# EAGLE board Melody (EAGLE 6.5.0)
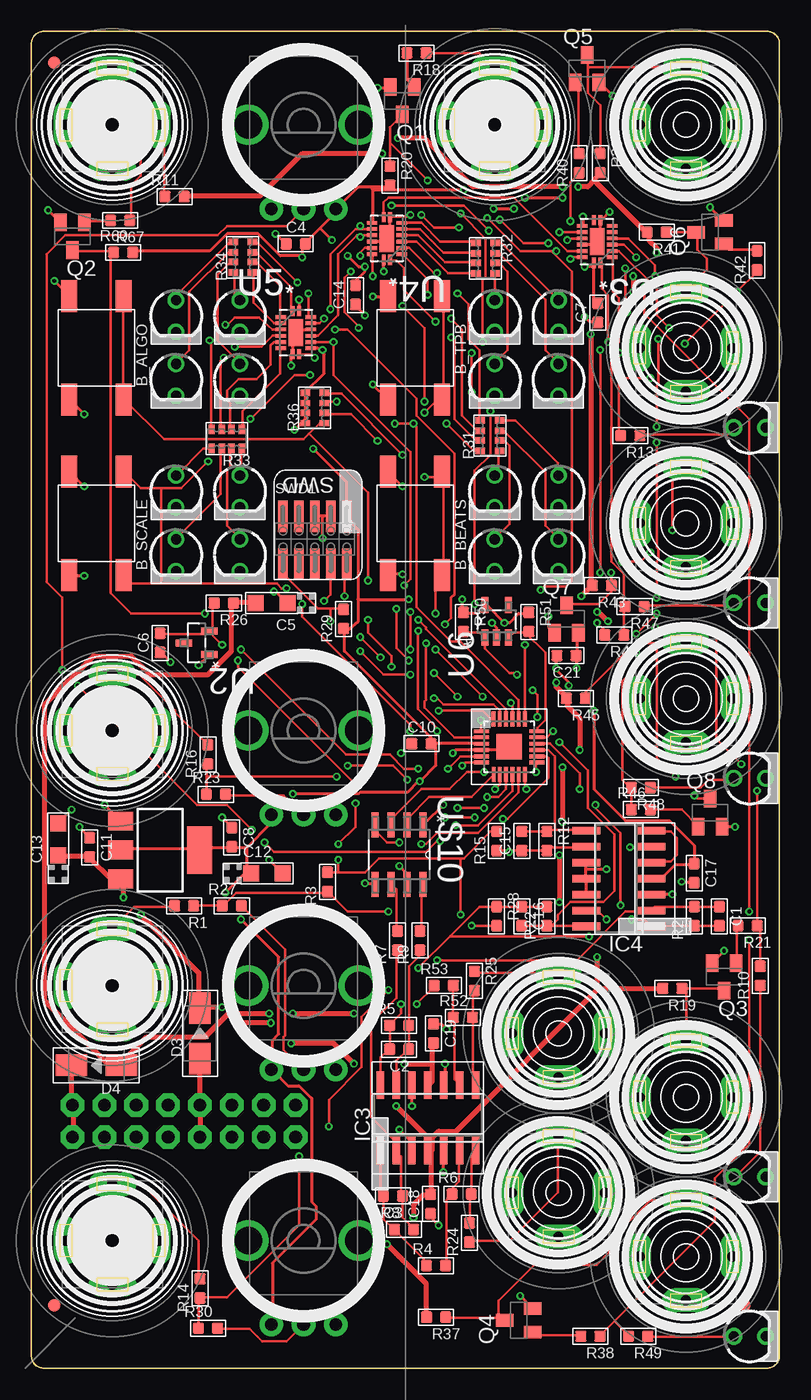
[diagram p2: board, top side]
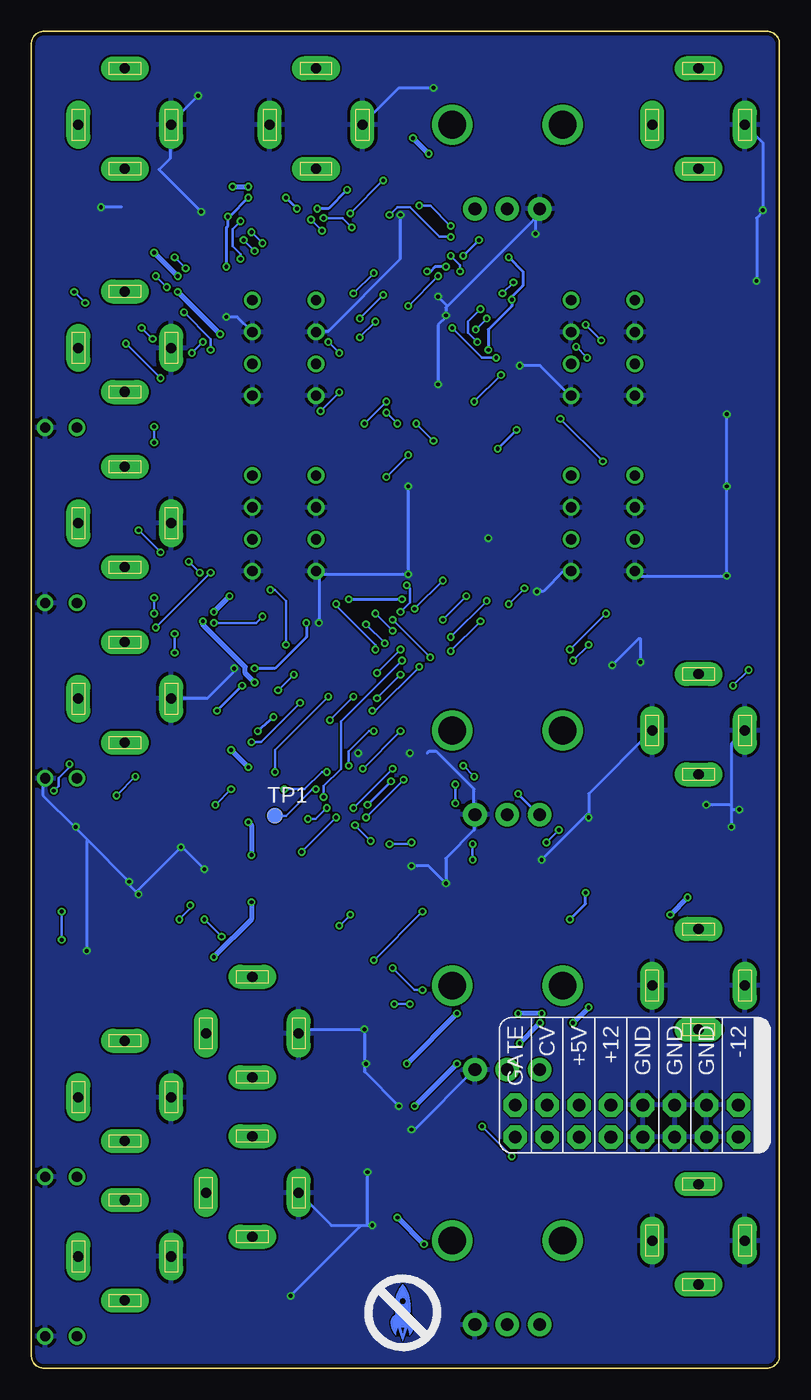
[diagram p3: board, bottom side, seen from below]

Size 59.62 x 106.5 mm. Coordinates in mm from the lower left corner, seen from the top.
Copper layers (1*16): Top 0.035mm / dielectric 1.5mm / Bottom 0.035mm
Design rules "dirt_cheap_dirty_boards.v1": minimum track width 5mil, minimum drill 12mil, track to track 5mil, track to pad 5mil, pad to pad 5mil, via to via 5mil, smd to smd 0mil, copper to edge 10mil, drill to drill 10mil, minimum pad ring 10mil, minimum via ring 6mil, stop-mask expansion 2mil, vias tented up to drill 25mil, thermal gap 10mil
Net classes: 0 default: width 0.203 mm, clearance 0.203 mm; 1 heavypower: width 0.381 mm; 2 mediumpower: width 0.254 mm

## Footprints (pad centres in the part's own frame; a part is rotated, then mirrored left to right if it is on the bottom)
3.5MM-JACK-SWITCH-13MM-OUTPUT = drill 0.8 pad 1.93 long: RING@3 -3.7,0; SECOND@3 0,-3.5; SWITCH@3 3.7,0; TIP@3 0,4.5
4P-SMD-6.0X6.0X5.0H = smd 2.54 x 1.27: 1 -4.129,2.159; 2 -4.129,-2.159; 3 4.129,-2.159; 4 4.129,2.159
C0603 = smd 0.889 x 0.889: 1 -0.762,0; 2 0.762,0
AVX-A = smd 1.27 x 1.27: + -1.27,0; - 1.27,0
3.5MM-JACK-SWITCH-13MM-INPUT = drill 0.8 pad 1.93 long: RING@3 -3.7,0; SECOND@3 0,-3.5; SWITCH@3 3.7,0; TIP@3 0,4.5
DO-214AC = smd 2.5 x 1.7: 1 -2,0; 2 2,0
SOT223 = smd 1.5 x 2: 1 -2.3,-3.15; 2 0,-3.15; 3 2.3,-3.15 | smd 3.8 x 2: 4 0,3.15
SO14 = smd 0.6 x 2.2: 1 -3.81,-2.6; 2 -2.54,-2.6; 3 -1.27,-2.6; 4 0,-2.6; 5 1.27,-2.6; 6 2.54,-2.6; 7 3.81,-2.6; 8 3.81,2.6; 9 2.54,2.6; 10 1.27,2.6; 11 0,2.6; 12 -1.27,2.6; 13 -2.54,2.6; 14 -3.81,2.6
LED3MM = drill 0.813: A -1.27,0; K 1.27,0
OG-POTS_ALPS_POT_VERTICAL = drill 1 pad 1.88: P$1 -2.58,-6.7; P$2 0,-6.7; P$3 2.58,-6.7 | drill 2.2 pad 3.175: P$4 4.4,0; P$5 -4.4,0
SOT23-BEC = smd 1 x 1.4: B -0.95,-1.1; C 0,1.1; E 0.95,-1.1
R0603 = smd 0.889 x 0.889: 1 -0.762,0; 2 0.762,0
R1206-8 = smd 0.508 x 0.762: 1 -1.206,-0.762; 2 -0.381,-0.762; 3 0.381,-0.762; 4 1.206,-0.762; 5 1.206,0.762; 6 0.381,0.762; 7 -0.381,0.762; 8 -1.206,0.762
M50-3600542 = smd 0.75 x 2.5: 1 -2.54,-1.81; 2 -2.54,2; 3 -1.27,-1.81; 4 -1.27,2; 5 0,-1.81; 6 0,2; 7 1.27,-1.81; 8 1.27,2; 9 2.54,-1.81; 10 2.54,2
B1,27 = smd 1.27 x 1.27: TP 0,0
QFN50P400X400X100-25N = smd 1.2 x 0.3: 1 -2.2,1.245; 2 -2.2,0.762; 3 -2.2,0.254; 4 -2.2,-0.254; 5 -2.2,-0.762; 6 -2.2,-1.245; 13 2.2,-1.245; 14 2.2,-0.762; 15 2.2,-0.254; 16 2.2,0.254; 17 2.2,0.762; 18 2.2,1.245 | smd 0.3 x 1.2: 7 -1.245,-2.2; 8 -0.762,-2.2; 9 -0.254,-2.2; 10 0.254,-2.2; 11 0.762,-2.2; 12 1.245,-2.2; 19 1.245,2.2; 20 0.762,2.2; 21 0.254,2.2; 22 -0.254,2.2 | smd 0.305 x 1.2: 23 -0.762,2.2; 24 -1.245,2.2 | smd 2.032 x 2.032: 25 0,0
SOT95P237X112-3N = smd 1.321 x 0.559: 1 -1.016,0.94; 2 -1.016,-0.94; 3 1.016,0
QFN50P250X350X100-17N = smd 0.305 x 0.813: 1 -0.254,1.702; 8 -0.254,-1.702; 9 0.254,-1.702; 16 0.254,1.702 | smd 0.813 x 0.305: 2 -1.194,1.245; 3 -1.194,0.762; 4 -1.194,0.254; 5 -1.194,-0.254; 6 -1.194,-0.762; 7 -1.194,-1.245; 10 1.194,-1.245; 11 1.194,-0.762; 12 1.194,-0.254; 13 1.194,0.254; 14 1.194,0.762; 15 1.194,1.245 | smd 1.143 x 2.159: 17 0,0
SOT95P290X145-5N = smd 1.27 x 0.559: 1 -1.295,0.94; 2 -1.295,0; 3 -1.295,-0.94; 4 1.295,-0.94; 5 1.295,0.94
POWER_16 = drill 1.016 pad 1.88 octagon: 1 -6.35,-1.27; 2 -6.35,1.27; 3 -3.81,-1.27; 4 -3.81,1.27; 5 -1.27,-1.27; 6 -1.27,1.27; 7 1.27,-1.27; 8 1.27,1.27; 9 3.81,-1.27; 10 3.81,1.27; 11 6.35,-1.27; 12 6.35,1.27; 13 8.89,-1.27; 14 8.89,1.27; 15 11.43,-1.27; 16 11.43,1.27
FIDUCIAL_1MM = smd 1 x 1: 1 0,0
SOIC8-N_MC = smd 1.981 x 0.559: 1 -2.362,1.905; 2 -2.362,0.635; 3 -2.362,-0.635; 4 -2.362,-1.905; 5 2.362,-1.905; 6 2.362,-0.635; 7 2.362,0.635; 8 2.362,1.905

## Placement (x,y rotation side)
ACCENT  PJ-341  [3.5MM-JACK-SWITCH-13MM-OUTPUT]  52.17,21.59 0 top
B_ALGO  BUTTON-4P-3100010P1  [4P-SMD-6.0X6.0X5.0H]  5.18,81.28 270 top
B_BEATS  BUTTON-4P-3100010P1  [4P-SMD-6.0X6.0X5.0H]  30.58,67.31 270 top
B_SCALE  BUTTON-4P-3100010P1  [4P-SMD-6.0X6.0X5.0H]  5.18,67.31 270 top
B_TPB  BUTTON-4P-3100010P1  [4P-SMD-6.0X6.0X5.0H]  30.58,81.28 270 top
BEAT  PJ-341  [3.5MM-JACK-SWITCH-13MM-OUTPUT]  52.17,67.31 0 top
C1  3.3nF  [C0603]  54.83,36 270 top
C2  3.3nF  [C0603]  29.31,25.4 180 top
C3  3.3nF  [C0603]  28.81,13.72 180 top
C4  100nF  [C0603]  21.06,89.57 0 top
C5  10uF  [AVX-A]  19.15,60.96 180 top
C6  1uF  [C0603]  10.26,57.78 90 top
C7  100nF  [C0603]  45.14,84.08 90 top
C8  100nF  [C0603]  15.97,42.3 270 top
C10  100nF  [C0603]  31.08,49.75 0 top
C11  100nF  [C0603]  4.65,41.49 270 top
C12  10uF  [AVX-A]  18.77,39.41 0 top
C13  10uF  [AVX-A]  2.15,42.12 90 top
C14  100nF  [C0603]  25.83,85.5 90 top
C15  3.3nF  [C0603]  39.08,42 90 top
C16  3.3nF  [C0603]  39.08,36 270 top
C17  100nF  [C0603]  52.81,39.43 270 top
C18  100nF 16V+  [C0603]  31.81,13.08 90 top
C19  100nF 16V+  [C0603]  32.06,26.66 270 top
C21  100nF  [C0603]  42.64,56.77 180 top
CLOCK  PJ-341  [3.5MM-JACK-SWITCH-13MM-INPUT]  6.45,99.06 0 top
CLOCKOUT_JACK  PJ-341  [3.5MM-JACK-SWITCH-13MM-OUTPUT]  52.17,99.06 0 top
D3  MRA4004T3G  [DO-214AC]  13.44,26.67 90 top
D4  MRA4004T3G  [DO-214AC]  5.18,24.13 180 top
GATE  PJ-341  [3.5MM-JACK-SWITCH-13MM-OUTPUT]  52.17,8.89 0 top
IC1  LD1117AS33TR  [SOT223]  10.26,41.27 270 top
IC3  TL074D  [SO14]  31.6,19.93 0 top
IC4  MCP6004  [SO14]  46.83,39 90 top
IN1  PJ-341  [3.5MM-JACK-SWITCH-13MM-INPUT]  6.45,50.8 0 top
IN2  PJ-341  [3.5MM-JACK-SWITCH-13MM-INPUT]  6.45,30.48 0 top
INTENSITY  PJ-341  [3.5MM-JACK-SWITCH-13MM-INPUT]  6.45,10.16 0 top
LED_ACCENT  WHITE 3MM WITH 11MM HOLDER  [LED3MM]  57.25,15.24 0 top
LED_ALGO_FLAT  WHITE_WITH_11MM_SPACER  [LED3MM]  11.53,83.82 270 top
LED_ALGO_FOURCHORD  WHITE 3MM WITH 11MM HOLDER  [LED3MM]  16.61,83.82 270 top
LED_ALGO_GOA  WHITE 3MM WITH 11MM HOLDER  [LED3MM]  11.53,78.74 270 top
LED_ALGO_PSYCH  WHITE 3MM WITH 11MM HOLDER  [LED3MM]  16.61,78.74 270 top
LED_BEAT  WHITE 3MM WITH 11MM HOLDER  [LED3MM]  57.25,60.96 0 top
LED_BEAT_2  WHITE 3MM WITH 11MM HOLDER  [LED3MM]  42.01,69.85 270 top
LED_BEAT_4  WHITE 3MM WITH 11MM HOLDER  [LED3MM]  36.93,69.85 270 top
LED_BEAT_8  WHITE 3MM WITH 11MM HOLDER  [LED3MM]  36.93,64.77 270 top
LED_BEAT_16  WHITE 3MM WITH 11MM HOLDER  [LED3MM]  42.01,64.77 270 top
LED_GATE  WHITE 3MM WITH 11MM HOLDER  [LED3MM]  57.25,2.54 0 top
LED_LOOP  WHITE 3MM WITH 11MM HOLDER  [LED3MM]  57.25,46.99 0 top
LED_SCALE_DORIAN  WHITE 3MM WITH 11MM HOLDER  [LED3MM]  11.53,64.77 270 top
LED_SCALE_MAJOR  WHITE 3MM WITH 11MM HOLDER  [LED3MM]  11.53,69.85 270 top
LED_SCALE_MINOR  WHITE 3MM WITH 11MM HOLDER  [LED3MM]  16.61,64.77 270 top
LED_SCALE_PENTA  WHITE 3MM WITH 11MM HOLDER  [LED3MM]  16.61,69.85 270 top
LED_TICK  WHITE 3MM WITH 11MM HOLDER  [LED3MM]  57.25,74.93 0 top
LED_TPB_2  WHITE 3MM WITH 11MM HOLDER  [LED3MM]  42.01,83.82 270 top
LED_TPB_3  WHITE 3MM WITH 11MM HOLDER  [LED3MM]  42.01,78.74 270 top
LED_TPB_4  WHITE 3MM WITH 11MM HOLDER  [LED3MM]  36.93,83.82 270 top
LED_TPB_6  WHITE 3MM WITH 11MM HOLDER  [LED3MM]  36.93,78.74 270 top
LOOP  PJ-341  [3.5MM-JACK-SWITCH-13MM-OUTPUT]  52.17,53.34 0 top
NOTE  PJ-341  [3.5MM-JACK-SWITCH-13MM-OUTPUT]  42.01,13.97 0 top
POT_IN1  SEED A  [OG-POTS_ALPS_POT_VERTICAL]  21.69,50.8 0 top
POT_IN2  SEED B  [OG-POTS_ALPS_POT_VERTICAL]  21.69,30.48 0 top
POT_TEMPO  TEMPO  [OG-POTS_ALPS_POT_VERTICAL]  21.69,99.06 0 top
Q1  MMBT3904  [SOT23-BEC]  29.56,100.97 180 top
Q2  MMBT3904  [SOT23-BEC]  3.28,90.17 180 top
Q3  MMBT3904  [SOT23-BEC]  55.21,31.18 180 top
Q4  MMBT3904  [SOT23-BEC]  38.84,3.81 90 top
Q5  MMBT3904  [SOT23-BEC]  44.27,103.53 0 top
Q6  MMBT3904  [SOT23-BEC]  54.08,90.5 90 top
Q7  MMBT3904  [SOT23-BEC]  42.64,59.69 0 top
Q8  MMBT3904  [SOT23-BEC]  54.08,44.25 0 top
R1  100k 1%  [R0603]  12.17,36.83 180 top
R2  33k 1%  [R0603]  52.83,36 90 top
R3  49.9k 1%  [R0603]  23.59,38.73 90 top
R4  100k  [R0603]  32.25,8.17 0 top
R5  25.5k 1%  [R0603]  29.31,27.3 0 top
R6  100k  [R0603]  34.29,13.87 0 top
R7  10.2k 1%  [R0603]  29.17,34.06 90 top
R8  25.5k 1%  [R0603]  29.7,11.04 0 top
R9  10.2k 1%  [R0603]  30.96,34.06 90 top
R10  2k  [R0603]  58.08,31.25 90 top
R11  10k  [R0603]  11.42,93.34 0 top
R12  33k 1%  [R0603]  41.08,42 270 top
R13  2k  [R0603]  47.73,74.3 180 top
R14  100k 1%  [R0603]  13.44,6.35 90 top
R15  49.9k 1%  [R0603]  37.08,42 90 top
R16  100k 1%  [R0603]  14.07,48.9 90 top
R17  INTENSITY  [OG-POTS_ALPS_POT_VERTICAL]  21.69,10.16 0 top
R18  100k  [R0603]  30.7,104.78 180 top
R19  10k  [R0603]  51.08,30.25 180 top
R20  10k  [R0603]  28.58,95 270 top
R21  100k  [R0603]  57.08,35.25 180 top
R22  33k 1%  [R0603]  41.08,36 90 top
R23  33k 1%  [R0603]  14.71,45.72 0 top
R24  100  [R0603]  34.91,10.79 90 top
R25  100  [R0603]  35.31,30.85 270 top
R26  10k  [R0603]  15.34,60.96 180 top
R27  33k 1%  [R0603]  15.97,36.83 0 top
R28  49.9k  [R0603]  37.08,36 270 top
R29  10k  [R0603]  24.87,59.69 90 top
R30  33k 1%  [R0603]  14.07,3.17 0 top
R31  2k  [R1206-8]  36.55,74.3 90 top
R32  2k  [R1206-8]  36.19,88.43 270 top
R33  2k  [R1206-8]  15.57,74.05 180 top
R34  2k  [R1206-8]  16.84,88.51 90 top
R36  10k  [R1206-8]  22.58,76.5 90 top
R37  10k  [R0603]  32.25,4.06 180 top
R38  100k  [R0603]  44.55,2.54 180 top
R39  10k  [R0603]  45.33,96 270 top
R40  100k  [R0603]  43.66,95.99 90 top
R41  10k  [R0603]  49.83,90.5 180 top
R42  100k  [R0603]  57.83,88.25 90 top
R43  10k  [R0603]  45.46,62.35 180 top
R44  100k  [R0603]  46.45,58.42 180 top
R45  10k  [R0603]  43.39,53.36 180 top
R46  100k  [R0603]  48.58,44.5 0 top
R47  2k  [R0603]  48.07,60.67 180 top
R48  2k  [R0603]  48.58,46.25 180 top
R49  2k  [R0603]  48.36,2.54 180 top
R50  2k  [R0603]  34.43,59.45 270 top
R51  2k  [R0603]  39.64,59.45 270 top
R52  100k  [R0603]  34.39,27.94 0 top
R53  100k  [R0603]  32.87,30.48 0 top
R60  10k  [R0603]  7.32,88.89 0 top
R67  100k  [R0603]  7.09,91.44 180 top
RESET  PJ-341  [3.5MM-JACK-SWITCH-13MM-INPUT]  36.93,99.06 0 top
SWD1  CORTEX_SWD  [M50-3600542]  22.59,66.06 180 top
TICK  PJ-341  [3.5MM-JACK-SWITCH-13MM-OUTPUT]  52.17,81.28 0 top
TP1  TPB1,27  [B1,27]  40.2,44 0 bottom
U1  MKL02Z32VFK4  [QFN50P400X400X100-25N]  38.08,49.5 0 top
U2  LM4040DIM3-5.0  [SOT95P237X112-3N]  13.17,57.78 180 top
U3  74HC595BQ  [QFN50P250X350X100-17N]  45.08,89.75 180 top
U4  74HC595BQ  [QFN50P250X350X100-17N]  28.33,90 180 top
U5  74HC595BQ  [QFN50P250X350X100-17N]  21.08,82.5 0 top
U6  24LC00T-I/OT  [SOT95P290X145-5N]  37.08,59.5 90 top
U$1  POWER  [POWER_16]  9.62,19.68 180 bottom
U$2  EURORACK_PCB12HP  [EURORACK12HPPCB]  -0.5,0 0 top
U$4  FIDUCIAL  [FIDUCIAL_1MM]  1.83,5 0 top
U$7  FIDUCIAL  [FIDUCIAL_1MM]  56.83,5 0 top
U$8  FIDUCIAL  [FIDUCIAL_1MM]  1.83,104 0 top
U$10  MCP4822-E/SN  [SOIC8-N_MC]  29.31,40.91 270 top
U$19  SMALLROCKET  [SMALLROCKET]  30.33,4.1 0 bottom
VELOCITY  PJ-341  [3.5MM-JACK-SWITCH-13MM-OUTPUT]  42.01,26.67 0 top

## Tracks (layer width: path | path; a pad name or v marks a point on that pad's centre or on a via)
3.3V  (via drill 0.3)
  Top 0.254: IC1.2 7.21,41.38 13.33,41.38 IC1.4 13.46,41.38 13.58,41.5 15.96,41.5 C8.2 16.08,41.5 17.2,41.5 | R17.P$1 19.2,3.5 19.2,8.38 22.7,11.88 22.7,12.88 22.33,13.25 22.33,21.5 21.33,22.5 20.45,22.5 19.2,23.75 POT_IN2.P$1 19.2,23.88 19.2,26.12 19.7,26.62 19.7,32.75 v16.7,35.75 | v15.46,37.88 17.2,39.62 C12.+ 17.2,39.75 17.2,41.5 | 52.83,40.25 C17.1 | v28.08,87.38 28.08,88.25 U4.16 | C14.2 25.83,86.62 26.58,87.38 v26.58,87.75 26.08,87.75 v25.2,88.62 | v22.45,73.25 25.08,70.62 25.08,67.88 SWD1.1 25.2,67.75 26.03,66.83 26.03,61.25 | v20.95,74.75 21.7,75.5 R36.8 21.83,75.38 21.83,76 R36.7 R36.6 21.83,77 21.83,77.62 R36.5 21.83,77.75 23.33,79.25 23.33,80.75 23.14,80.94 | v21.33,85.12 21.33,84.25 U5.16 | R60.2 8.21,89 14.21,89 15.58,90.38 18.08,90.38 19.83,88.62 21.45,88.62 v21.58,88.5 21.58,89.38 21.7,89.5 C4.2 21.83,89.62 23.02,90.81 | C7.2 45.08,84.88 44.83,85.12 44.83,88 U3.16 44.7,87.75 v44.08,87.75 | 27.2,94.12 26.08,94.12 24.33,92.38 POT_TEMPO.P$3 24.2,92.25 24.2,92 23.02,90.81 | 27.2,94.12 28.58,94.12 R20.2 | v43.95,91.75 43.95,91 U3.10 | 23.14,80.94 22.83,81.25 22.33,81.25 U5.10 | 27.2,93.88 27.2,91.25 U4.10 | 27.2,93.88 27.2,94.12 | v23.2,81.12 23.2,81 23.14,80.94 | v39.33,93.25 v42.33,93.25 | v36.83,92.38 v38.45,92.38 | 27.2,93.88 v34.45,93.88 | 23.02,90.81 v23.95,89.88 | C10.2 35.83,49.75 U1.3 | v32.83,44.88 31.33,43.38 U$10.1 | C10.2 32.2,49.62 32.2,48 v30.95,46.75 30.83,46.75 29.95,45.88 26.2,45.88 26.08,45.75 v20.83,45.75 | C21.2 41.83,56.75 v41.83,55.75 41.83,55.62 42.83,54.62 v42.83,54.38 | R51.1 39.58,60.12 38.83,60.12 38.08,59.38 v37.7,59.38 36.33,60.75 U6.5 36.2,60.75 35.58,60.12 34.45,60.12 R50.1 34.33,60.25 v34.33,61.25
  Top 0.254: v44.83,52.38 44.83,46.12 47.33,43.62 50.83,43.62 52.83,41.62 52.83,40.38 C17.1 | 17.2,41.5 19.08,43.38 19.08,44 POT_IN1.P$1 | C10.2 32.2,49.88 24.95,57.12 24.95,58.88 R29.1 25.08,58.88 25.33,58.88 26.03,59.48 26.03,61.25 | 26.03,61.25 v30.08,61.25 | IC4.4 50.2,39 51.33,40.12 52.7,40.12 C17.1
  Bottom 0.254: v15.46,37.88 15.46,37 v16.7,35.75 | v28.08,87.38 27.83,87.38 27.45,87.75 v26.58,87.75 | v20.95,74.75 v22.45,73.25 | v21.58,88.5 20.45,87.38 20.45,86.25 21.33,85.38 v21.33,85.12 21.33,84.62 23.2,82.75 v23.2,81.12 | v44.08,87.75 44.08,90.88 43.95,91 v43.95,91.75 43.83,91.75 v42.33,93.25 | v38.45,92.38 v39.33,93.25 | v36.83,92.38 35.95,92.38 v34.45,93.88 | v23.95,89.88 v25.2,88.62 | v30.95,46.75 v32.83,44.88 | v41.83,55.75 40.2,55.75 37.7,58.25 v37.7,59.38 | v42.83,54.38 v44.83,52.38 | v20.83,45.75 19.2,44.12 POT_IN1.P$1 | v30.08,61.25 v34.33,61.25
12V  (via drill 0.3)
  Top 0.381: v27.95,96.75 21.58,96.75 18.2,93.38 12.21,93.38 R11.2 | v29.2,98 31.33,98 35.2,94.12 v42.33,94.12 | v43.58,94.12 44.33,94.12 44.83,94.62 | 44.83,94.62 45.33,95.12 R39.2 | 44.83,94.62 48.95,90.5 R41.2 49.2,90.38 49.2,89.88 49.83,89.25 v49.83,88.88 | v8.71,36.12 13.33,31.5 13.33,28.75 D3.2 13.58,28.75 v15.21,28.75 | v7.33,37.5 7.33,38.75 7.21,38.88 IC1.3 7.08,39 6.33,39 4.71,40.62 C11.2 4.46,40.75 2.21,40.75 C13.+ | v28.33,9.88 31.45,6.75 31.45,4.12 R37.2 | v30.45,12 30.45,13 31.2,13.75 31.7,13.75 C18.2 31.83,14 31.83,17.25 | 31.83,17.25 IC3.4 31.83,18.12 v29.08,20.88 | v43.83,61.5 44.58,62.25 R43.2 44.58,62.5 v44.58,82.38 | v45.08,60.25 45.2,60.25 v45.95,59.5 | v41.83,54.62 41.83,54.25 42.58,53.5 R45.2 42.7,53.25 42.7,52.75 43.7,51.75 v43.7,49.25 | v47.95,87 v47.95,85.75 | 45.2,30.25 R19.2 | 45.2,30.25 33.83,18.88 32.45,18.88 31.95,18.38 31.95,17.38 31.83,17.25 | v19.08,27.5 v16.45,27.5 | v20.7,25.88 24.08,25.88 v25.7,24.25 | v45.08,32.75 45.08,30.38 45.2,30.25 | v42.08,40.88 v42.08,37.12 | v42.33,47.88 v42.33,43.5
  Bottom 0.381: v29.2,98 v27.95,96.75 | v43.58,94.12 v42.33,94.12 | v7.33,37.5 v8.71,36.12 | v30.45,12 v28.33,9.88 | v45.08,60.25 v43.83,61.5 | v45.95,59.5 45.95,59.25 42.58,55.88 42.58,55.38 v41.83,54.62 | v47.95,85.75 v44.58,82.38 | v49.83,88.88 v47.95,87 | v16.45,27.5 v15.21,28.75 | v20.7,25.88 v19.08,27.5 | v29.08,20.88 v25.7,24.25 | v45.08,32.75 42.08,35.75 v42.08,37.12 | v42.08,40.88 42.08,43.25 v42.33,43.5 | v43.7,49.25 v42.33,47.88
-12V  (via drill 0.3)
  Top 0.381: C5.- 17.83,61 16.2,61 R26.1 15.96,60.88 15.96,57.12 14.08,55.25 9.46,55.25 7.96,56.75 4.96,56.75 1.08,52.88 1.08,29.25 6.08,24.25 7.08,24.25 D4.1 7.21,24.38 9.21,26.38 13.83,26.38 15.71,28.25 v18.95,28.25 | 31.95,24.25 31.95,22.88 31.7,22.62 IC3.11 | 31.95,24.25 31.95,25.88 C19.2 | v29.7,24.25 31.95,24.25 | v20.83,28.25 v25.7,28.25
  Bottom 0.381: v25.7,28.25 v29.7,24.25 | v18.95,28.25 v20.83,28.25
ADC_IN1
  Top 0.203: C15.2 R12.1 41.2,42.88 41.7,42.88 | 41.7,42.88 44.2,42.88 IC4.8 | 41.7,42.88 41.7,48.75 41.2,49.25 40.33,49.25 U1.15
ADC_IN2  (via drill 0.3)
  Top 0.203: R2.1 C1.2 | R2.1 49.45,35.25 IC4.1 49.33,35.25 48.83,35.75 v47.83,35.75 | R2.1 | v43.7,46.12 43.7,47.38 41.33,49.75 40.33,49.75 U1.16 | v44.95,44.88 44.95,44.62 46.95,42.62 v46.95,36.88
  Bottom 0.203: v44.95,44.88 v43.7,46.12 | v46.95,36.88 46.95,36.62 v47.83,35.75
ADC_INTENSITY  (via drill 0.3)
  Top 0.203: R22.1 C16.2 | v38.2,53 38.33,52.88 38.33,51.75 U1.21 | v42.08,49.88 44.33,47.62 44.33,44.62 46.45,42.5 46.45,38 45.58,37.12 42.95,37.12 41.95,36.12 41.95,35.75 41.52,35.31 | 41.52,35.31 41.45,35.25 R22.1 | R22.1 | IC4.14 44.2,35.25 41.58,35.25 41.52,35.31
  Bottom 0.203: v38.2,53 41.33,49.88 v42.08,49.88
BUTTON_ALGO  (via drill 0.3)
  Top 0.203: B_ALGO.1 7.33,85.38 7.33,77.25 B_ALGO.4 7.46,77.12 10.58,74 21.7,74 22.14,74.44 | 22.14,74.44 22.95,75.25 23.33,75.25 R36.1 | v36.33,45.5 37.2,45.5 37.83,46.12 37.83,47.25 U1.9 | v30.08,56.38 29.08,57.38 v29.08,60.5 | v26.83,62.75 26.83,69.75 22.14,74.44
  Bottom 0.203: v36.33,45.5 36.33,46.38 34.95,47.75 34.95,51.5 v30.08,56.38 | v26.83,62.75 v29.08,60.5
BUTTON_BEATS  (via drill 0.3)
  Top 0.203: 32.83,71 32.83,63.25 B_BEATS.4 32.7,63.12 32.2,62.62 v32.2,60.12 | 32.83,71 32.83,71.38 B_BEATS.1 32.83,71 | v29.58,72.75 24.7,77.62 23.45,77.62 R36.4 | 32.83,71 v31.33,71 | v34.33,48 34.58,48.25 35.83,48.25 U1.6 | v32.33,50.75 32.33,51 30.83,52.5 v30.83,58.75
  Bottom 0.203: v34.33,48 34.33,49.12 32.7,50.75 v32.33,50.75 | v32.2,60.12 v30.83,58.75 | v31.33,71 v29.58,72.75
BUTTON_SCALE  (via drill 0.3)
  Top 0.203: v24.33,77 23.45,77 R36.3 | v22.2,79.12 20.95,79.12 v17.45,75.62 | v14.08,72.25 11.96,70.12 10.33,70.12 | 10.33,70.12 8.71,70.12 7.46,71.38 B_SCALE.1 | v33.2,47.75 34.2,48.75 35.83,48.75 U1.5 | v30.2,50.75 30.2,51.25 21.58,59.88 v21.58,60.88 | v20.33,62.12 19.95,62.12 19.58,62.5 10.33,62.5 | 10.33,62.5 8.08,62.5 7.46,63.12 B_SCALE.4 | 10.33,62.5 10.33,70.12
  Bottom 0.203: v22.2,79.12 v24.33,77 | v14.08,72.25 v17.45,75.62 | v30.2,50.75 v33.2,47.75 | v20.33,62.12 v21.58,60.88
BUTTON_TPB  (via drill 0.3)
  Top 0.203: 32.83,77.62 32.83,77.25 B_TPB.4 32.83,77.62 | 32.83,77.62 32.83,85.38 B_TPB.1 | v27.58,73.88 25.45,76 23.45,76 R36.2 | v28.95,75.25 v30.45,75.25 30.7,75 30.7,60.62 33.45,57.88 34.2,57.88 38.83,53.25 38.83,51.75 U1.20 | 32.83,77.62 v31.33,76.12
  Bottom 0.203: v28.95,75.25 v27.58,73.88 | v31.33,76.12 v30.45,75.25
CLOCK  (via drill 0.3)
  Top 0.203: v23.83,84.38 23.83,88.75 25.83,90.75 26.2,90.75 | 26.2,90.75 27.08,90.75 U4.11 | U5.11 22.33,81.75 v24.08,81.75 24.08,79.12 30.2,73 30.2,62.88 v29.7,62.38 | v42.08,90.5 43.83,90.5 U3.11 | v41.2,89.62 39.2,89.62 v37.33,91.5 | v36.45,90.62 34.45,92.62 v28.7,92.62 | 26.2,90.75 v26.2,91 | v35.83,51.62 35.83,50.75 U1.1 | v32.08,55.38 v33.95,53.5 | v30.2,60.25 v30.2,57.25
  Bottom 0.203: v24.08,81.75 24.83,82.5 24.83,83.38 v23.83,84.38 | v41.2,89.62 v42.08,90.5 | v36.45,90.62 v37.33,91.5 | v28.7,92.62 27.83,92.62 v26.2,91 | v33.95,53.5 v35.83,51.62 | v30.2,57.25 v32.08,55.38 | v30.2,60.25 29.45,61 29.45,62.12 v29.7,62.38
CLOCK_IN  (via drill 0.3)
  Top 0.203: 6.33,89 3.33,89 Q2.C | 6.33,89 6.46,89 R60.1 6.33,89 | v37.58,43.75 37.95,43.75 41.2,47 41.2,48.62 41.08,48.75 40.33,48.75 U1.14 | v33.95,44.62 v36.08,44.62 | v30.83,47.75 29.7,47.75 28.58,48.88 25.08,48.88 v16.7,57.25 | v13.83,60.12 7.96,60.12 6.33,61.75 6.33,89
  Bottom 0.203: v37.58,43.75 36.95,43.75 v36.08,44.62 | v30.83,47.75 v33.95,44.62 | v13.83,60.12 v16.7,57.25
CPU_RESET  (via drill 0.3)
  Top 0.203: 23.83,60.5 22.83,60.5 20.08,63.25 20.08,64 SWD1.10 | 23.83,60.5 24.83,60.5 R29.2 | v32.08,53.38 32.33,53.38 32.83,52.88 36.83,52.88 37.33,52.38 37.33,51.75 U1.23 | v30.2,55.25 28.08,55.25 v26.2,57.12 | 23.83,60.5 v23.83,59.5
  Bottom 0.203: v30.2,55.25 v32.08,53.38 | v23.83,59.5 v26.2,57.12
DACCS
  Top 0.203: U1.7 36.83,47.25 35.08,45.5 31.7,45.5 29.95,43.75 29.95,43.38 U$10.2
DACSCK  (via drill 0.3)
  Top 0.203: v39.45,46.12 39.33,46.25 39.33,47.25 U1.12 | v36.08,47.5 34.7,47.5 33.33,46.12 31.08,46.12 28.7,43.75 28.7,43.38 U$10.3
  Bottom 0.203: v39.45,46.12 37.83,46.12 36.45,47.5 v36.08,47.5
DACSDI  (via drill 0.3)
  Top 0.203: v31.08,41.75 31.45,41.75 32.33,42.62 35.58,42.62 38.83,45.88 38.83,47.25 U1.11 | v29.33,41.88 28.33,41.88 27.45,42.75 27.45,43.25 U$10.4
  Bottom 0.203: v31.08,41.75 29.45,41.75 v29.33,41.88
GND  (via drill 0.3)
  Top 0.254: IC4.12 44.2,37.75 44.2,39 IC4.11 44.2,39.12 44.2,39.75 | 44.2,39.75 44.2,40.25 IC4.10 | 23.2,67.88 23.83,67.88 SWD1.3 | 23.2,67.88 22.7,67.88 SWD1.5 | U4.13 27.2,89.75 28.08,89.75 U4.17 28.33,90.12 28.58,90.38 28.58,91.62 U4.8 28.7,91.75 30.08,91.75 v30.2,91.88 | U3.13 43.95,89.5 44.83,89.5 U3.17 45.08,89.88 45.33,90.12 45.33,91.38 U3.8 45.45,91.5 v46.08,92.12 | U5.13 22.2,82.75 21.45,82.75 21.2,82.5 U5.17 20.83,82.25 20.83,80.88 U5.8 20.7,80.75 v20.7,79.88 | Q7.E 43.58,58.5 43.45,58.38 43.45,56.88 C21.1 43.45,56.75 v43.45,55.75 | v3.83,43.12 4.58,42.38 C11.1 | v15.21,43.88 15.96,43.12 C8.1 | v29.45,49 30.2,49.75 C10.1 | v11.08,56.25 10.33,57 C6.1 | v19.45,90.38 20.2,89.62 C4.1 | v44.08,83.75 44.45,83.38 45.08,83.38 C7.1 | v26.58,83.88 25.83,84.62 C14.1 | v51.83,38.75 52.7,38.75 C17.2 | v18.95,40.5 19.95,39.5 C12.- | v3.21,44.5 2.21,43.5 C13.- | v19.33,61.88 19.45,61.88 20.33,61 C5.+ | U6.2 37.08,59 v36.7,59.38 | v13.33,56 14.08,56.75 U2.1 | v1.33,92.25 2.21,91.38 Q2.E | v27.58,102 28.58,102 Q1.E | v55.2,33.25 54.33,32.38 Q3.E | v56.08,43.12 55.08,43.12 Q8.E | v54.08,92.5 55.08,91.5 Q6.E | v46.33,101.38 45.33,102.38 Q5.E | v26.58,38.62 27.33,38.62 U$10.5 | v29.33,40 29.83,39.5 29.83,38.62 U$10.7 | v5.83,44.88 7.08,43.62 IC1.1 | v51.08,37.75 49.45,37.75 IC4.3 | v47.7,41.5 49.33,41.5 IC4.6 | v4.21,63.12 3.08,63.12 B_SCALE.3 | v4.21,70.25 3.08,71.38 B_SCALE.2 | v4.21,76 3.08,77.12 B_ALGO.3 | v1.83,86.62 2.96,85.5 B_ALGO.2 | v29.58,63.25 28.45,63.25 B_BEATS.3 | v29.58,70.25 28.45,71.38 B_BEATS.2 | v27.2,78.38 28.33,77.25 B_TPB.3 | v27.2,85.38 28.33,85.38 B_TPB.2 | v23.2,66.12 23.2,67.88 | v45.83,39.75 44.2,39.75
  Top 0.254: U1.25 37.83,49.25 35.95,49.25 U1.4 35.83,49.25 33.83,49.25 v33.58,49 | v32.45,11.38 31.83,12 31.83,12.25 C18.1 | v33.08,27 32.7,27.38 32.08,27.38 C19.1 | v38.95,5.75 39.83,4.88 Q4.E | IC3.3 30.33,18 v29.33,19 | v32.83,15.62 32.83,17.25 IC3.5 | v30.33,20.88 IC3.12 | v32.95,24.25 32.95,22.62 IC3.10
  Bottom 0.254: 3.83,44.88 3.83,49.75 2.83,50.75 IN1.RING@3 | 3.83,44.88 3.83,44.5 | 3.83,44.5 v3.83,43.12 | IN1.SWITCH@3 10.21,50.75 15.21,45.75 v15.21,43.88 15.33,44.12 v18.95,40.5 | 28.08,49 27.95,49.12 27.33,49.12 24.33,46.12 24.33,44.12 POT_IN1.P$3 24.33,44 24.33,42.88 26.58,40.62 v26.58,38.62 27.95,40 v29.33,40 | v11.08,56.25 11.08,58.12 11.21,58.12 v13.33,56 | LED_SCALE_DORIAN.K 11.46,63.5 11.08,63.12 v4.21,63.12 v4.21,70.25 v4.21,76 | 19.45,91.5 19.45,92 19.2,92.25 POT_TEMPO.P$1 | 19.45,91.5 v19.45,90.38 | v44.08,83.75 43.2,83.75 42.08,82.62 LED_TPB_2.K | 26.45,84.62 19.58,91.5 19.45,91.5 | 26.45,84.62 26.58,84.5 v26.58,83.88 26.58,83.75 27.2,83.12 v27.2,78.38 | 56.14,43.06 58.7,45.62 58.7,46.75 58.58,46.88 LED_LOOP.K | 56.14,43.06 55.14,42.06 | 55.14,42.06 v51.83,38.75 51.83,38.5 v51.08,37.75 51.2,38 v47.7,41.5 47.58,41.5 v45.83,39.75 | 3.83,44.5 v3.21,44.5 | LED_SCALE_MINOR.K 17.2,63.5 18.83,61.88 v19.33,61.88 19.08,62 | v36.7,59.38 36.7,63.38 36.83,63.5 LED_BEAT_8.K 36.58,63.25 v29.58,63.25 v29.58,70.25 | CLOCK.RING@3 2.71,99 1.33,97.62 v1.33,92.25 1.33,92.12 1.83,91.62 v1.83,86.62 | v27.58,102 30.33,102 33.2,99.12 RESET.RING@3 | v55.2,33.25 55.2,42 55.14,42.06 | v56.08,43.12 56.14,43.06 | 52.45,92.5 v54.08,92.5 | v46.33,101.38 48.58,99.12 CLOCKOUT_JACK.RING@3 48.58,99 48.58,96.38 49.45,95.5 v46.08,92.12 | v43.45,55.75 43.45,55.5 45.58,53.38 48.45,53.38 LOOP.RING@3 | 3.83,44.88 v5.83,44.88 | v20.7,79.88 19.08,79.88 16.7,77.5 LED_ALGO_PSYCH.K | v30.2,91.88 30.2,88.38 35.95,82.62 36.83,82.62 LED_TPB_4.K | 26.45,84.62 v27.2,85.38 | 33.45,11.38 35.7,11.38 38.2,13.88 NOTE.RING@3
  Bottom 0.254: 33.45,11.38 32.83,11.38 | 32.83,11.38 v32.45,11.38 | VELOCITY.RING@3 38.2,26.75 37.95,27 v33.08,27 33.08,24.25 | v38.95,5.75 33.45,11.25 33.45,11.38 | v29.33,19 29.08,19 24.33,23.75 POT_IN2.P$3 | 32.83,11.38 v32.83,15.62 | v30.33,20.88 33.08,23.62 33.08,24.25 | v32.95,24.25 33.08,24.25
  pour Bottom: -1.17,109.22 -1.17,-2.54 62.33,-2.54 62.33,109.22
KNOB_IN1
  Top 0.203: R23.2 15.58,45.62 20.08,45.62 21.58,44.12 POT_IN1.P$2
KNOB_IN2
  Top 0.203: POT_IN2.P$2 21.58,23.88 20.08,25.38 20.08,26.38 20.2,26.5 20.2,33.38 16.83,36.75 R27.2
KNOB_INTENSITY
  Top 0.203: R30.2 14.96,3.12 17.41,3.12 18.41,2.12 20.33,2.12 21.58,3.38 R17.P$2
KNOB_TEMPO  (via drill 0.3)
  Top 0.203: v33.83,43.25 35.58,43.25 38.33,46 38.33,47.25 U1.10 | v32.58,42 32.33,42 31.45,41.12 19.33,41.12 v18.58,41.88 | v17.58,42.88 15.58,44.88 13.21,44.88 v3.71,54.38 | v2.46,55.62 2.46,61.38 1.21,62.62 1.21,88.75 2.71,90.25 14.83,90.25 15.58,91 20.33,91 POT_TEMPO.P$2
  Bottom 0.203: v32.58,42 v33.83,43.25 | v17.58,42.88 v18.58,41.88 | v2.46,55.62 v3.71,54.38
LATCH  (via drill 0.3)
  Top 0.203: 26.2,90.25 27.08,90.25 U4.12 | 26.2,90.25 25.95,90.25 24.45,88.75 24.45,83.88 22.83,82.25 22.33,82.25 U5.12 | v42.7,89.88 42.83,90 43.83,90 U3.12 | 41.45,89 38.95,89 v36.33,91.62 | 41.45,89 v41.83,89 | v34.08,90.88 32.08,90.88 v31.08,91.88 | 26.2,90.25 v26.2,90.12 | v39.33,57.62 39.33,51.75 U1.19 | v40.58,62 40.83,62.25 42.58,62.25 43.08,62.75 43.08,87.38 41.45,89
  Bottom 0.203: v41.83,89 v42.7,89.88 | v36.33,91.62 34.83,91.62 v34.08,90.88 | v31.08,91.88 30.45,92.5 29.45,92.5 27.08,90.12 v26.2,90.12 | v39.33,57.62 39.33,61.12 40.2,62 v40.58,62
N$1  (via drill 0.3)
  Top 0.203: v33.45,82.12 33.7,81.88 33.7,75.62 35.33,74 35.7,74 R31.7 | v32.2,83.38 29.7,85.88 29.7,87.62 29.08,88.25 28.7,88.25 U4.1
  Bottom 0.203: v32.2,83.38 v33.45,82.12
N$2
  Top 0.203: R4.2 33.08,8.25 33.08,13.38 33.45,13.75 R6.1 33.58,13.88 33.58,14.38 34.08,14.88 34.08,17.25 IC3.6
N$3
  Top 0.203: R16.2 13.96,49.75 11.46,52.25 11.46,52.38 8.58,55.25 6.46,55.25 IN1.TIP@3
N$4  (via drill 0.3)
  Top 0.203: C15.1 38.08,41.25 | 38.08,41.25 R15.1 | R12.2 C15.1 | C15.1 | R12.2 41.33,41.5 44.2,41.5 IC4.9 | R12.2 | 13.96,47.12 13.96,48.12 R16.1 | 13.96,47.12 13.96,45.75 R23.1 | v24.33,47.12 13.96,47.12 | v25.2,48 28.83,48 v29.95,46.88 | v35.33,43.88 v32.95,43.88 | 38.08,41.25 v38.08,41.12
  Bottom 0.203: v25.2,48 v24.33,47.12 | v32.95,43.88 v29.95,46.88 | v38.08,41.12 v35.33,43.88
N$5
  Top 0.203: R9.2 31.08,34.88 31.08,38.38 31.2,38.5 U$10.8
N$6
  Top 0.203: R1.2 11.33,36.75 8.21,36.75 6.46,35 IN2.TIP@3
N$7
  Top 0.203: R7.2 29.08,34.88 29.08,38.12 28.7,38.5 U$10.6
N$8  (via drill 0.3)
  Top 0.203: R1.1 12.96,36.88 15.21,36.88 R27.1 15.33,36.88 16.33,37.88 23.58,37.88 R3.1 23.7,37.88 25.2,36.38 v28.45,36.38 | R2.2 C1.1 | R2.2 49.7,36.75 49.45,36.5 IC4.2 49.33,36.38 47.33,36.38 43.45,32.5 v32.33,32.5 | R2.2
  Bottom 0.203: v28.45,36.38 v32.33,32.5
N$9
  Top 0.203: R9.1 30.95,33.25 30.95,32.88 30.08,32 30.08,27.38 R5.2 30.08,27.25 30.08,25.5 C2.1 29.95,25.38 29.08,24.5 29.08,22.62 IC3.13
N$10
  Top 0.203: R8.2 30.45,11.12 29.58,12 29.58,13.62 C3.1 29.45,13.75 29.45,16.88 29.08,17.25 IC3.2 28.95,17.38 28.95,18.12 27.08,20 27.08,27.5 29.08,29.5 29.08,33.25 R7.1
N$13
  Top 0.381: D3.1 13.46,24.62 13.46,21 U$1.9 13.46,20.88 13.46,18.5 U$1.10
N$14
  Top 0.203: R24.2 34.95,11.62 34.95,13.75 R6.2 35.08,13.88 35.08,17 35.33,17.25 IC3.7
N$15
  Top 0.203: R18.2 29.95,104.75 29.95,102.62 30.45,102.12 Q1.B
N$16
  Top 0.203: R18.1 31.58,104.75 35.7,104.75 36.83,103.62 RESET.TIP@3
N$17
  Top 0.203: R53.2 33.58,30.38 33.58,28 R52.1 33.7,27.88 33.7,23 34.08,22.62 IC3.9
N$18
  Top 0.203: R4.1 31.45,8.25 31.45,8.5 28.95,11 R8.1 28.83,11.12 28.08,11.88 28.08,13.62 C3.2 27.95,13.75 27.83,13.88 27.83,17.25 IC3.1
N$19  (via drill 0.3)
  Top 0.203: v33.45,83.62 34.33,82.75 34.33,75.88 35.45,74.75 35.7,74.75 R31.6 | v31.58,85.5 31.58,86.75 29.58,88.75 U4.2
  Bottom 0.203: v31.58,85.5 v33.45,83.62
N$20
  Top 0.203: R25.1 35.33,31.5 41.7,31.5 41.95,31.25 VELOCITY.TIP@3
N$21
  Top 0.203: R24.1 34.95,10.12 38.08,10.12 41.95,14 41.95,18.38 NOTE.TIP@3
N$24  (via drill 0.3)
  Top 0.203: v30.7,29 32.08,30.38 R53.1 | v29.45,29 29.45,28.25 28.58,27.38 R5.1 28.58,27.25 28.58,25.5 C2.2 28.45,25.38 27.83,24.75 27.83,22.62 IC3.14
  Bottom 0.203: v29.45,29 v30.7,29
N$25
  Top 0.203: R21.2 56.2,35.25 56.2,32.38 Q3.B
N$26  (via drill 0.3)
  Top 0.203: v33.95,85.62 34.83,84.75 34.83,82 35.7,81.12 35.7,75.62 R31.5 | v32.33,87.25 32.08,87.25 30.08,89.25 29.58,89.25 U4.3
  Bottom 0.203: v32.33,87.25 v33.95,85.62
N$27
  Top 0.203: R32.4 35.33,87.25 33.2,87.25 30.7,89.75 29.58,89.75 U4.4
N$28
  Top 0.203: R33.6 15.08,73.25 15.08,69.62 11.58,66.12 LED_SCALE_DORIAN.A
N$29
  Top 0.203: 52.2,30.25 55.08,30.25 55.2,30.12 Q3.C | 52.2,30.25 52.2,26.12 ACCENT.TIP@3 | 52.2,30.25 R19.1
N$30
  Top 0.203: R32.3 35.33,88.12 32.95,88.12 30.83,90.25 29.58,90.25 U4.5
N$31
  Top 0.203: R32.2 35.33,88.88 32.83,88.88 30.95,90.75 29.58,90.75 U4.6
N$32
  Top 0.203: R33.5 14.33,73.25 13.71,73.25 11.58,71.12 LED_SCALE_MAJOR.A
N$33
  Top 0.203: R14.2 13.33,7.12 13.33,10.12 8.83,14.62 6.46,14.62 INTENSITY.TIP@3
N$34  (via drill 0.3)
  Top 0.203: R30.1 13.33,3.25 13.33,5.5 R14.1 13.46,5.62 15.58,5.62 21.33,11.38 v21.33,16.88 | C16.1 R28.1 | C16.1 R22.2 | C16.1 | v23.7,19.25 23.7,21.38 26.33,24 26.33,28 v28.45,30.12 | 33.39,34.44 35.7,36.75 R28.1 | 33.39,34.44 v30.83,31.88 | R28.1 | v45.83,35.75 45.2,36.38 44.33,36.38 IC4.13 | v44.45,34.38 33.45,34.38 33.39,34.44
  Bottom 0.203: v23.7,19.25 v21.33,16.88 | v28.45,30.12 29.08,30.12 v30.83,31.88 | v44.45,34.38 v45.83,35.75
N$35
  Top 0.203: R32.1 35.33,89.75 32.58,89.75 31.08,91.25 29.58,91.25 U4.7
N$36  (via drill 0.3)
  Top 0.203: v33.08,75.25 35.2,73.12 35.7,73.12 R31.8 | v31.33,77 31.33,82.88 v29.58,84.62 | v27.2,87 27.2,88.75 U4.15
  Bottom 0.203: v31.33,77 v33.08,75.25 | v27.2,87 v29.58,84.62
N$37  (via drill 0.3)
  Top 0.203: v21.2,86.5 18.08,89.62 17.7,89.62 R34.4 | v22.08,85.62 22.08,83.88 22.2,83.75 U5.15
  Bottom 0.203: v22.08,85.62 v21.2,86.5
N$38
  Top 0.203: R34.3 17.7,88.88 17.95,88.88 20.7,86.12 20.7,84.25 U5.1
N$39
  Top 0.203: R34.2 17.7,88.12 17.95,88.12 19.83,86.25 19.83,83.75 U5.2
N$40
  Top 0.203: R34.1 17.7,87.25 17.7,84.88 19.33,83.25 19.83,83.25 U5.3
N$41  (via drill 0.3)
  Top 0.203: v14.21,81.88 14.33,81.75 14.33,74.88 R33.4 | v15.46,83.12 15.63,83.12 16.2,83.7 18.16,83.7 19.2,82.75 19.83,82.75 U5.4
  Bottom 0.203: v15.46,83.12 v14.21,81.88
N$42  (via drill 0.3)
  Top 0.203: v15.33,80.5 15.08,80.25 15.08,74.88 R33.3 | v16.2,81.38 18.33,81.38 19.2,82.25 19.83,82.25 U5.5
  Bottom 0.203: v16.2,81.38 v15.33,80.5
N$43
  Top 0.203: R67.1 7.96,91.5 7.96,94.25 8.71,95 8.71,101.25 6.46,103.5 CLOCK.TIP@3
N$48
  Top 0.203: R33.2 15.83,74.88 15.83,76.88 15.58,77.12 15.58,77.88 16.51,78.8 17.93,78.8 19.08,79.95 19.08,81.5 19.33,81.75 19.83,81.75 U5.6
N$49
  Top 0.203: R33.1 16.83,74.88 16.83,76.25 19.83,79.25 19.83,81.25 U5.7
N$57
  Top 0.203: R38.2 43.7,2.62 40.08,2.62 39.95,2.75 Q4.B
N$58
  Top 0.203: R37.1 33.08,4 37.58,4 37.7,3.88 Q4.C 37.83,3.88 37.33,3.88 37.2,4 37.2,5.38 40.08,8.25 45.08,8.25 46.08,9.25 46.08,10.12 49.33,13.38 52.08,13.38 GATE.TIP@3
N$60
  Top 0.203: R40.2 43.58,96.88 43.58,102.12 43.33,102.38 Q5.B
N$61
  Top 0.203: R39.1 45.33,100.62 44.33,101.62 44.33,103.62 | 44.33,103.62 44.33,104.62 Q5.C | 44.33,103.62 52.08,103.62 CLOCKOUT_JACK.TIP@3
N$63
  Top 0.203: R42.2 57.83,89.12 55.58,89.12 55.2,89.5 Q6.B
N$64
  Top 0.381: D4.2 3.21,24.12 3.21,21 U$1.1 3.33,20.88 3.33,18.5 U$1.2
N$65
  Top 0.203: R41.1 Q6.C 53.08,90.5 53.08,89.12 53.83,88.38 53.83,87.5 52.2,85.88 TICK.TIP@3
N$66
  Top 0.203: R67.2 6.21,91.38 4.33,91.38 Q2.B
N$68  (via drill 0.3)
  Top 0.203: v45.08,59.38 45.58,58.88 45.58,58.5 R44.2 | v41.2,59.88 41.2,59 41.58,58.62 Q7.B
  Bottom 0.203: v45.08,59.38 41.7,59.38 v41.2,59.88
N$69  (via drill 0.3)
  Top 0.203: Q7.C 42.7,60.88 45.2,60.88 46.2,61.88 46.2,62.25 R43.1 46.2,62.38 v46.2,63.38 | v47.08,64.25 48.58,64.25 v49.33,65 | v51.08,66.75 51.08,70.75 52.08,71.75 BEAT.TIP@3
  Bottom 0.203: v47.08,64.25 v46.2,63.38 | v51.08,66.75 v49.33,65
N$71
  Top 0.203: R46.2 51.83,44.5 53.08,43.25 Q8.B
N$72  (via drill 0.3)
  Top 0.203: 49.83,57.75 52.08,57.75 LOOP.TIP@3 | 49.83,57.75 48.08,57.75 44.2,53.88 44.2,53.38 R45.1 | v52.83,45.62 53.08,45.38 54.08,45.38 Q8.C | v51.33,47.12 49.83,48.62 49.83,57.75
  Bottom 0.203: v51.33,47.12 v52.83,45.62
N$73
  Top 0.203: R34.6 16.08,88.88 15.71,88.88 12.58,85.75 12.58,81.12 11.58,80.12 LED_ALGO_GOA.A
N$74
  Top 0.203: R34.5 16.08,89.62 15.71,89.62 11.58,85.5 11.58,85.12 LED_ALGO_FLAT.A
N$75
  Top 0.203: R34.7 15.83,88.12 14.83,87.12 14.83,81.88 16.58,80.12 LED_ALGO_PSYCH.A
N$76
  Top 0.203: R34.8 16.2,87.25 16.2,85.5 16.58,85.12 LED_ALGO_FOURCHORD.A
N$77
  Top 0.203: R33.7 15.83,73.25 15.83,71.75 15.58,71.5 15.58,67.12 16.58,66.12 LED_SCALE_MINOR.A
N$78
  Top 0.203: R33.8 16.7,73.25 16.7,71.12 LED_SCALE_PENTA.A
N$79
  Top 0.203: R31.3 37.33,74.62 37.7,74.62 40.95,71.38 40.95,67.12 41.95,66.12 LED_BEAT_16.A
N$80
  Top 0.203: R31.2 37.33,73.88 37.58,74 38.08,73.5 38.08,67.25 36.95,66.12 LED_BEAT_8.A
N$81
  Top 0.203: R31.1 37.2,73 37.2,71.38 36.95,71.12 LED_BEAT_4.A
N$82
  Top 0.203: R31.4 37.33,75.5 38.58,75.5 41.95,72.12 41.95,71.12 LED_BEAT_2.A
N$83
  Top 0.203: R32.8 36.95,89.62 37.45,89.62 41.95,85.12 LED_TPB_2.A
N$84
  Top 0.203: R32.7 36.95,88.75 37.33,88.75 40.95,85.12 40.95,81.12 41.95,80.12 LED_TPB_3.A
N$85
  Top 0.203: R32.5 36.95,87.12 36.95,85.12 LED_TPB_4.A
N$86
  Top 0.203: R32.6 36.95,88 37.33,88 37.95,87.38 37.95,81.12 36.95,80.12 LED_TPB_6.A
N$90
  Top 0.203: R13.1 48.58,74.38 55.45,74.38 55.95,74.88 LED_TICK.A
N$91
  Top 0.203: R48.1 53.33,46.25 53.95,46.88 55.95,46.88 LED_LOOP.A
N$92
  Top 0.203: R49.1 49.2,2.5 55.95,2.5 LED_GATE.A
N$93
  Top 0.203: R47.1 48.95,60.75 55.83,60.75 55.95,60.88 LED_BEAT.A
N$94
  Top 0.203: R25.2 35.2,30 35.2,28 R52.2 35.2,27.88 35.2,22.75 35.33,22.62 IC3.8
N$95
  Top 0.203: R10.1 58.08,17.25 56.08,15.25 LED_ACCENT.A
N$96
  Top 0.203: 10.58,98.62 10.21,99 CLOCK.SWITCH@3 10.58,98.62 | 10.58,98.62 10.58,93.38 R11.1
N$97
  Top 0.203: IC4.5 49.45,40.38 50.95,40.38 51.45,40.88 51.45,42.25 50.95,42.75 49.45,42.75 IC4.7
OUT_ACCENT  (via drill 0.3)
  Top 0.203: R10.2 58.08,35.12 57.95,35.25 R21.1 v57.83,46 | v48.2,88.5 47.2,89.5 46.33,89.5 U3.4 | v47.33,87.62 47.33,84.25 v47.45,84.12 | v45.33,63.38 v45.33,81.12 | v49.7,59 50.45,59 50.58,59.12 53.7,59.12 54.58,58.25 54.58,50.12 v56.58,48.12
  Bottom 0.203: v47.33,87.62 v48.2,88.5 | v47.45,84.12 45.33,82 v45.33,81.12 | v49.7,59 v45.33,63.38 | v56.58,48.12 56.58,47.88 57.45,47 57.45,46.38 v57.83,46
OUT_BEAT
  Top 0.203: U3.2 46.33,88.5 46.33,85.75 46.83,85.25 46.83,81.75 46.2,81.12 46.2,64.25 47.2,63.25 47.2,60.75 R47.2 47.2,60.62 47.2,58.5 R44.1
OUT_CLOCK  (via drill 0.3)
  Top 0.203: v42.95,88.38 43.08,88.5 43.83,88.5 U3.15 | v42.95,91.38 42.95,94.5 43.58,95.12 R40.1
  Bottom 0.203: v42.95,88.38 42.95,88.75 43.58,89.38 43.58,90.75 v42.95,91.38
OUT_GATE  (via drill 0.3)
  Top 0.203: v49.7,87 49.7,87.88 47.58,90 46.33,90 U3.5 | v48.83,86.12 48.83,84 57.2,75.62 v57.2,36.38 | v57.2,34.12 57.2,17.88 54.45,15.12 54.45,11.75 46.45,3.75 | 46.45,3.75 45.33,2.62 R38.1 | 46.45,3.75 47.58,2.62 R49.2
  Bottom 0.203: v48.83,86.12 v49.7,87 | v57.2,34.12 v57.2,36.38
OUT_LOOP  (via drill 0.3)
  Top 0.203: R46.1 R48.2 47.7,46.25 47.08,46.88 47.08,54.75 48.2,55.88 v48.2,57 | v50.83,82.88 49.83,83.88 49.83,86 46.83,89 46.33,89 U3.3 | v49.95,82 49.95,78.38 49.83,78.25 v49.83,75 | v49.83,73.75 49.83,65.38 49.95,65.25 49.95,64.38 49.83,64.25 v49.83,61.38 | v48.2,58.5 v49.83,60.12
  Bottom 0.203: v49.95,82 v50.83,82.88 | v49.83,73.75 v49.83,75 | v49.83,60.12 v49.83,61.38 | v48.2,57 v48.2,58.5
OUT_TICK  (via drill 0.3)
  Top 0.203: v45.95,81.75 45.95,85.5 45.45,86 45.45,88 U3.1 | 46.83,78.88 46.83,74.5 46.95,74.38 R13.2 | 46.83,78.88 v46.83,80.88 | v56.2,85.75 57.83,87.38 R42.1 | v52.08,81.62 v55.33,84.88 | 46.83,78.88 v49.33,78.88
  Bottom 0.203: v46.83,80.88 v45.95,81.75 | v55.33,84.88 v56.2,85.75 | v49.33,78.88 v52.08,81.62
PTA6  (via drill 0.3)
  Top 0.203: v36.95,46.12 37.33,46.5 37.33,47.25 U1.8
  Bottom 0.203: TP1.TP 39.33,44 37.2,46.12 v36.95,46.12
REF_-5V  (via drill 0.3)
  Top 0.203: C6.2 10.33,58.5 13.96,58.5 14.08,58.62 U2.2 | R26.2 14.46,60.88 14.46,59 14.21,58.75 U2.2 | 24.45,39.5 26.58,39.5 27.7,40.62 34.2,40.62 | 24.45,39.5 23.7,39.5 R3.2 | 34.2,40.62 34.45,40.62 36.58,42.75 R15.2 | v35.08,35.25 R28.2 | 34.2,40.62 v34.2,36.12 | v15.21,57.62 14.21,58.62 U2.2 | v16.45,56.38 16.45,55.88 v25.83,46.5 | v25.83,45 25.83,43.12 v24.45,41.75 | 24.45,39.5 v24.45,40.5
  Bottom 0.203: v34.2,36.12 v35.08,35.25 | v16.45,56.38 v15.21,57.62 | v25.83,45 v25.83,46.5 | v24.45,40.5 v24.45,41.75
RESET_PATTERN  (via drill 0.3)
  Top 0.203: 28.58,97.62 28.58,98.88 29.45,99.75 Q1.C | 28.58,97.62 R20.1 | v40.2,47.5 40.2,48.25 U1.13 | v32.2,57.25 v35.95,53.5 | v35.33,60.88 35.33,71.5 36.58,72.75 v36.58,76.25 | v35.08,80.88 v35.08,77.75 | v35.95,81.75 35.95,86.62 36.2,86.88 36.2,90 v34.2,92 | 28.58,97.62 v31.58,94.62
  Bottom 0.203: v40.2,47.5 40.2,49.25 v35.95,53.5 | v32.2,57.25 32.2,57.62 35.33,60.75 v35.33,60.88 | v35.08,77.75 v36.58,76.25 | v35.95,81.75 v35.08,80.88 | v31.58,94.62 v34.2,92
SCL  (via drill 0.3)
  Top 0.203: R50.2 34.45,58.62 35.7,58.62 36.08,58.25 U6.1 36.14,57.31 38.08,55.38 38.58,55.38 v38.7,55.25 | v41.58,50.75 41.08,50.25 40.33,50.25 U1.17 | v40.33,51.88 40.33,53.62 v39.95,54
  Bottom 0.203: v40.33,51.88 v41.58,50.75 | v38.7,55.25 v39.95,54
SDA
  Top 0.203: 39.33,58.62 38.45,58.62 38.08,58.25 U6.3 | 39.33,58.62 39.58,58.62 R51.2 39.33,58.62 | 39.33,58.62 40.95,57 40.95,51.62 40.33,51 40.33,50.75 U1.18
SHIFTER1TO2  (via drill 0.3)
  Top 0.203: v22.58,80.5 22.33,80.75 21.45,80.75 U5.9 | v26.08,82.88 26.08,83 24.95,84.12 24.95,86.88 v25.45,87.38 | v26.2,88.62 26.2,88.88 26.58,89.25 27.08,89.25 U4.14
  Bottom 0.203: v22.58,80.5 23.7,80.5 v26.08,82.88 | v25.45,87.38 25.45,87.88 v26.2,88.62
SHIFTER2TO3
  Top 0.203: U4.9 28.08,91.75 28.08,92.88 28.45,93.25 38.45,93.25 42.7,89 43.83,89 U3.14
SHIFTERS  (via drill 0.3)
  Top 0.203: v23.33,83.62 22.95,83.25 22.33,83.25 U5.14 | v24.2,82.75 25.2,82.75 30.7,77.25 30.7,75.88 33.7,72.88 33.7,61.62 33.45,61.38 33.45,59.75 v32.95,59.25 | v31.45,57.75 31.45,53.25 31.33,53.12 31.33,52.62 33.7,50.25 35.83,50.25 U1.2
  Bottom 0.203: v24.2,82.75 v23.33,83.62 | v31.45,57.75 v32.95,59.25
SWD_CLK  (via drill 0.3)
  Top 0.203: v30.83,59.62 31.45,59 31.45,58.88 37.83,52.5 37.83,51.75 U1.22 | v26.2,58.25 v27.83,56.62 | SWD1.4 23.83,64 23.83,61.62 v23.33,61.12
  Bottom 0.203: v27.83,56.62 v30.83,59.62 | v23.33,61.12 v26.2,58.25
SWD_DIO  (via drill 0.3)
  Top 0.203: v32.45,52.38 35.95,52.38 36.58,51.75 36.83,51.75 U1.24 | v28.7,55.88 28.7,56.75 26.83,58.62 v26.83,59.62 | v24.95,61.5 24.95,63.88 25.08,64 SWD1.2
  Bottom 0.203: v32.45,52.38 32.2,52.38 v28.7,55.88 | v24.95,61.5 v26.83,59.62